# EAGLE design OvalLedBreakoutForArduino (EAGLE 6.5.0)
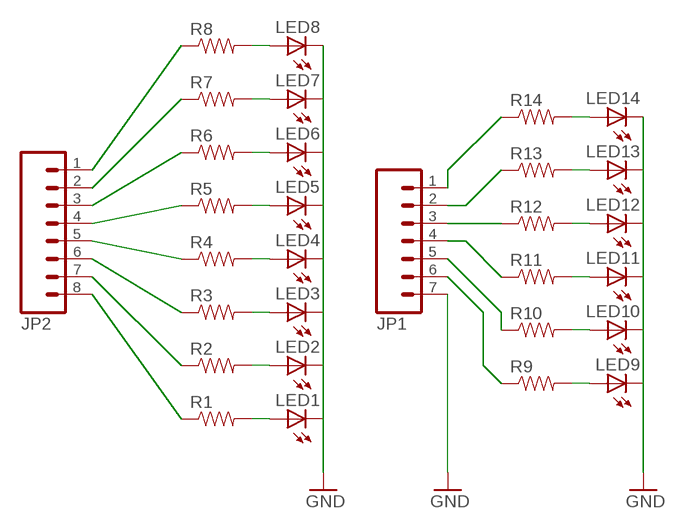
[diagram p0: schematic, sheet 1]

## Parts
JP1  M07  [1X07]
JP2  M081X08  [1X08]
LED1  LEDOVAL  [LED-OVAL]
LED2  LEDOVAL  [LED-OVAL]
LED3  LEDOVAL  [LED-OVAL]
LED4  LEDOVAL  [LED-OVAL]
LED5  LEDOVAL  [LED-OVAL]
LED6  LEDOVAL  [LED-OVAL]
LED7  LEDOVAL  [LED-OVAL]
LED8  LEDOVAL  [LED-OVAL]
LED9  LEDOVAL  [LED-OVAL]
LED10  LEDOVAL  [LED-OVAL]
LED11  LEDOVAL  [LED-OVAL]
LED12  LEDOVAL  [LED-OVAL]
LED13  LEDOVAL  [LED-OVAL]
LED14  LEDOVAL  [LED-OVAL]
R1  RESISTORAXIAL-0.3  [AXIAL-0.3]
R2  RESISTORAXIAL-0.3  [AXIAL-0.3]
R3  RESISTORAXIAL-0.3  [AXIAL-0.3]
R4  RESISTORAXIAL-0.3  [AXIAL-0.3]
R5  RESISTORAXIAL-0.3  [AXIAL-0.3]
R6  RESISTORAXIAL-0.3  [AXIAL-0.3]
R7  RESISTORAXIAL-0.3  [AXIAL-0.3]
R8  RESISTORAXIAL-0.3  [AXIAL-0.3]
R9  RESISTORAXIAL-0.3  [AXIAL-0.3]
R10  RESISTORAXIAL-0.3  [AXIAL-0.3]
R11  RESISTORAXIAL-0.3  [AXIAL-0.3]
R12  RESISTORAXIAL-0.3  [AXIAL-0.3]
R13  RESISTORAXIAL-0.3  [AXIAL-0.3]
R14  RESISTORAXIAL-0.3  [AXIAL-0.3]

## Nets
GND: JP1.7 LED1.CATHODE(C) LED2.CATHODE(C) LED3.CATHODE(C) LED4.CATHODE(C) LED5.CATHODE(C) LED6.CATHODE(C) LED7.CATHODE(C) LED8.CATHODE(C) LED9.CATHODE(C) LED10.CATHODE(C) LED11.CATHODE(C) LED12.CATHODE(C) LED13.CATHODE(C) LED14.CATHODE(C)
N$1: LED1.ANODE(A) R1.P$2
N$2: LED2.ANODE(A) R2.P$2
N$3: LED3.ANODE(A) R3.P$2
N$4: LED4.ANODE(A) R4.P$2
N$5: LED5.ANODE(A) R5.P$2
N$6: LED6.ANODE(A) R6.P$2
N$7: LED7.ANODE(A) R7.P$2
N$8: LED8.ANODE(A) R8.P$2
N$9: LED9.ANODE(A) R9.P$2
N$10: LED10.ANODE(A) R10.P$2
N$11: LED11.ANODE(A) R11.P$2
N$12: LED12.ANODE(A) R12.P$2
N$13: LED13.ANODE(A) R13.P$2
N$14: LED14.ANODE(A) R14.P$2
N$15: JP1.1 R14.P$1
N$16: JP1.2 R13.P$1
N$17: JP1.3 R12.P$1
N$18: JP1.4 R11.P$1
N$19: JP1.5 R10.P$1
N$20: JP1.6 R9.P$1
N$21: JP2.1 R8.P$1
N$22: JP2.2 R7.P$1
N$23: JP2.3 R6.P$1
N$24: JP2.4 R5.P$1
N$25: JP2.5 R4.P$1
N$26: JP2.6 R3.P$1
N$27: JP2.7 R2.P$1
N$28: JP2.8 R1.P$1

## Library data of the parts
JP1 = SparkFun-Connectors:M07: Header 7 Standard 7-pin 0.1" header. Use with straight break away headers (SKU : PRT-00116), right angle break away headers (PRT-00553), swiss pins (PRT-00743), machine pins (PRT-00117), and female headers (PRT-00115). NOTES ON THE VARIANTS LOCK and LOCK_LONGPADS... This footprint was designed to help hold the alignment of a through-hole component (i.e. 7-pin header) while soldering it into place. You may notice that each hole has been shifted either up or down by 0.005 of an inch from it's more standard position (which is usually a perfectly straight line). This slight alteration caused the pins (the squares in the middle) to touch the edges of the holes. Because they are alternating, it causes a "brace" to hold the header in place. 0.005 has proven to be the perfect amount of "off-center" position when using our standard breakaway headers. Although looks a little odd when you look at the bare footprint, once you have a header in there, the alteration is very hard to notice. Also, if you push a header all the way into place, it is covered up entirely on the bottom side. This idea of altering the position of holes to aid alignment will be further integrated into the Sparkfun Library for other footprints. It can help hold any component with 3 or more connection pins.
JP2 = SparkFun-Connectors:M08: Header 8 Standard 8-pin 0.1" header. Use with straight break away headers (SKU : PRT-00116), right angle break away headers (PRT-00553), swiss pins (PRT-00743), machine pins (PRT-00117), and female headers (PRT-00115).
LED1-LED14 = barbary_enterprises:LED: LEDs Standard schematic elements and footprints for 5mm, 3mm, 1206, and 0603 sized LEDs. 5mm - Spark Fun Electronics SKU : COM-00529 (and others)
R1-R14 = barbary_enterprises:RESISTOR: Resistor Basic schematic elements and footprints for 0603, 1206, and PTH resistors.

## Board
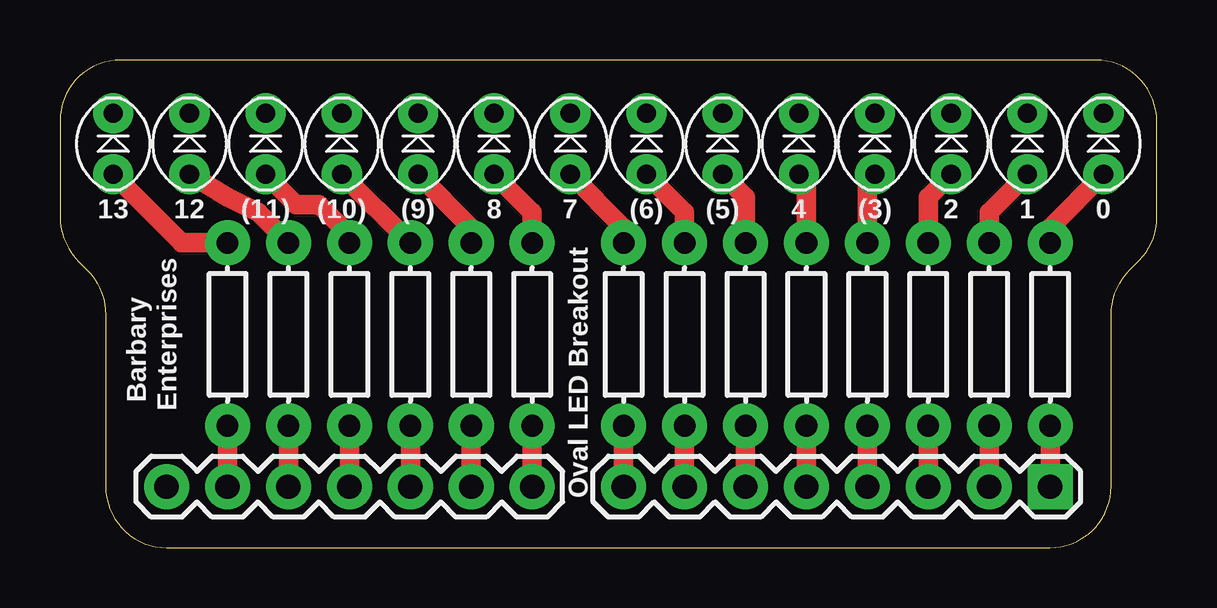
[diagram p1: board, top side]
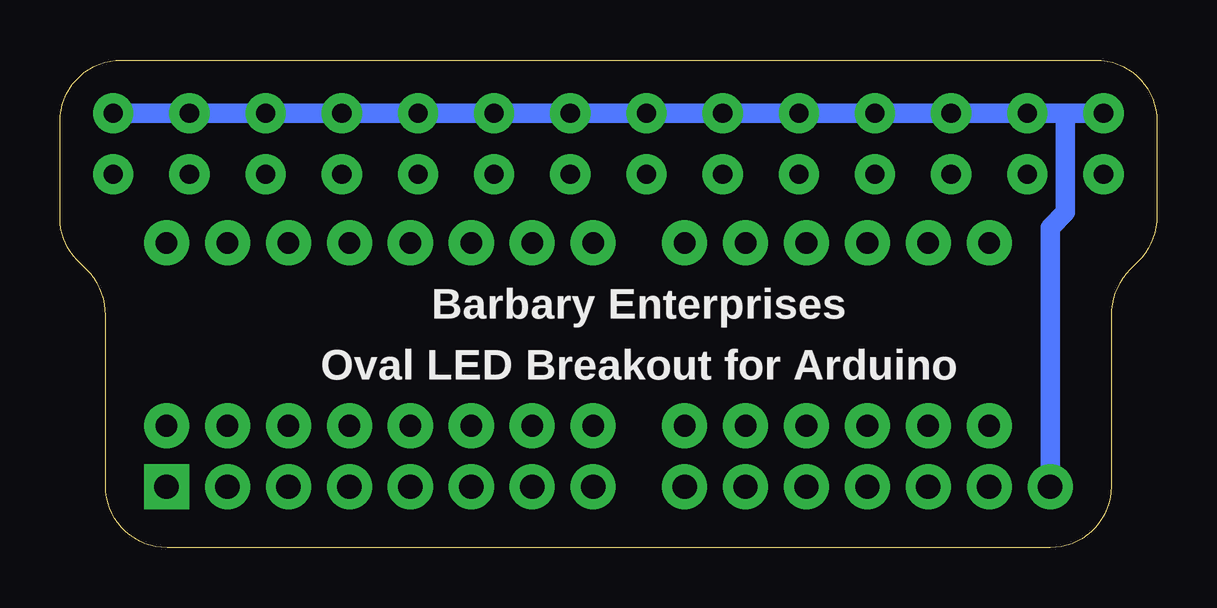
[diagram p2: board, bottom side, seen from below]

Size 45.72 x 20.32 mm. Coordinates in mm from the lower left corner, seen from the top.
Outline: 0,17.78 0,13.82 arc45 0.79,11.91 1.12,11.58 arc-45 1.91,9.68 1.91,2.54 arc90 4.45,0 41.26,0 arc90 43.81,2.56 43.81,9.68 arc-45 44.6,11.58 44.99,11.97 arc45 45.72,13.73 45.72,17.76 arc90 43.16,20.32 2.54,20.32 arc90 0,17.78
Copper layers (1*16): Top 0.035mm / dielectric 1.5mm / Bottom 0.035mm
Design rules "SmartPrototyping": minimum track width 7mil, minimum drill 12mil, track to track 7mil, track to pad 7mil, pad to pad 7mil, via to via 7mil, smd to smd 0mil, copper to edge 20mil, drill to drill 10mil, minimum pad ring 10mil, minimum via ring 6mil, stop-mask expansion 2mil, vias tented up to drill 25mil, thermal gap 10mil

### Footprints (pad centres in the part's own frame; a part is rotated, then mirrored left to right if it is on the bottom)
1X07 = drill 1.016 pad 1.88: 1 0,0; 2 2.54,0; 3 5.08,0; 4 7.62,0; 5 10.16,0; 6 12.7,0; 7 15.24,0
1X08 = drill 1.016 pad 1.88 square: 1 0,0 | drill 1.016 pad 1.88: 2 2.54,0; 3 5.08,0; 4 7.62,0; 5 10.16,0; 6 12.7,0; 7 15.24,0; 8 17.78,0
LED-OVAL = drill 0.8 pad 1.676: ANODE 1.27,0; CATHODE -1.27,0
AXIAL-0.3 = drill 0.9 pad 1.88: P$1 -3.81,0; P$2 3.81,0

### Placement (x,y rotation side)
JP1  19.68,2.54 180 top
JP2  41.27,2.54 180 top
LED1  21.27,16.83 270 top
LED2  24.45,16.83 270 top
LED3  27.62,16.83 270 top
LED4  30.8,16.83 270 top
LED5  33.97,16.83 270 top
LED6  37.15,16.83 270 top
LED7  40.32,16.83 270 top
LED8  43.5,16.83 270 top
LED9  2.22,16.83 270 top
LED10  5.4,16.83 270 top
LED11  8.57,16.83 270 top
LED12  11.75,16.83 270 top
LED13  14.92,16.83 270 top
LED14  18.1,16.83 270 top
R1  23.5,8.89 90 top
R2  26.04,8.89 90 top
R3  28.57,8.89 90 top
R4  31.11,8.89 90 top
R5  33.66,8.89 90 top
R6  36.2,8.89 90 top
R7  38.73,8.89 90 top
R8  41.27,8.89 90 top
R9  6.99,8.89 90 top
R10  9.53,8.89 90 top
R11  12.06,8.89 90 top
R12  14.61,8.89 90 top
R13  17.14,8.89 90 top
R14  19.68,8.89 90 top

### Tracks (layer width: path | path; a pad name or v marks a point on that pad's centre or on a via)
GND
  Bottom 0.813: JP1.7 4.45,13.34 3.81,13.97 3.81,18.1 | LED9.CATHODE 3.81,18.1 | 3.81,18.1 LED10.CATHODE LED11.CATHODE LED12.CATHODE LED13.CATHODE LED14.CATHODE LED1.CATHODE LED2.CATHODE LED3.CATHODE LED4.CATHODE LED5.CATHODE LED6.CATHODE LED7.CATHODE LED8.CATHODE
N$1
  Top 0.813: R1.P$2 23.5,13.34 LED1.ANODE
N$2
  Top 0.813: R2.P$2 26.04,13.97 LED2.ANODE
N$3
  Top 0.813: R3.P$2 28.57,14.61 LED3.ANODE
N$4
  Top 0.813: R4.P$2 31.11,15.24 LED4.ANODE
N$5
  Top 0.813: R5.P$2 33.66,15.24 LED5.ANODE
N$6
  Top 0.813: R6.P$2 36.2,14.61 LED6.ANODE
N$7
  Top 0.813: R7.P$2 38.73,13.97 LED7.ANODE
N$8
  Top 0.813: R8.P$2 41.27,13.34 LED8.ANODE
N$9
  Top 0.813: R9.P$2 5.08,12.7 LED9.ANODE
N$10
  Top 0.813: R10.P$2 8.26,13.97 6.99,14.61 LED10.ANODE
N$11
  Top 0.813: R11.P$2 12.06,13.02 10.79,14.29 9.84,14.29 LED11.ANODE
N$12
  Top 0.813: R12.P$2 LED12.ANODE
N$13
  Top 0.813: R13.P$2 17.14,13.34 LED13.ANODE
N$14
  Top 0.813: R14.P$2 19.68,13.97 LED14.ANODE
N$15
  Top 0.813: JP1.1 R14.P$1
N$16
  Top 0.813: JP1.2 R13.P$1
N$17
  Top 0.813: JP1.3 R12.P$1
N$18
  Top 0.813: JP1.4 R11.P$1
N$19
  Top 0.813: JP1.5 R10.P$1
N$20
  Top 0.813: JP1.6 R9.P$1
N$21
  Top 0.813: JP2.1 R8.P$1
N$22
  Top 0.813: JP2.2 R7.P$1
N$23
  Top 0.813: JP2.3 R6.P$1
N$24
  Top 0.813: JP2.4 R5.P$1
N$25
  Top 0.813: JP2.5 R4.P$1
N$26
  Top 0.813: JP2.6 R3.P$1
N$27
  Top 0.813: JP2.7 R2.P$1
N$28
  Top 0.813: JP2.8 R1.P$1

### Text on the board
tPlace: 13 | 12 | (11) | (10) | (9) | 8 | 7 | (6) | (5) | 4 | (3) | 2 | 1 | 0 | Enterprises | Barbary | Oval LED Breakout
bPlace: Barbary Enterprises | Oval LED Breakout for Arduino